# Altium project IRDiode_SWS.PrjPcb
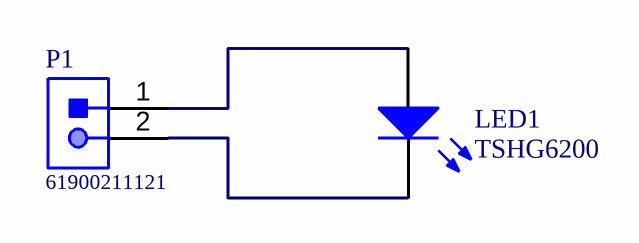
[diagram p0: IR_Diode_PCB.SchDoc]
1 sheet, 2 parts. Net scope: global (net labels, ports and power ports of the same name join across sheets).
Board file: IRDiode.PcbDoc

## Sheet IR_Diode_PCB.SchDoc: IR Diode PCB
size A3; DrawnBy: Fekunz; Revision: 1; SheetNumber: 1; SheetTotal: 1

### Parts
LED1  TSHG6200  [Type 5mm]
P1  61900211121  [61900211121]

### Nets
NetLED1_1: LED1.1(K) P1.2
NetLED1_2: LED1.2(A) P1.1

### Notes on the sheet
- Project:
- Drawn by:
- Size:
- Sheet
- A3
- Rev.:
- of
- Date:
- File:

### Library data of the parts
LED1 = CMP-1489-00005-1: PartNumber: 151053GS03000; Manufacturer: Wuerth Elektronik; Emitting color: Green; ComponentLink2URL: http://katalog.we-online.de/pbs/datasheet/7448042001.pdfhttp://katalog.we-online.de/pbs/datasheet/7448042001.pdfhttp://katalog.we-online.de/pbs/datasheet/7448042001.pdfhttp://katalog.we-online.de/pbs/datasheet/151053GS03000.pdf; ComponentLink2Description: Datasheet; ComponentLink1URL: http://www.we-online.com; PackageReference: Type 5mm; ComponentLink1Description: Manufacturer URL
P1 = CMP-1502-00584-1: Male Locking Header WR-WTB, THT, Vertical, pitch 2.54 mm, 1 x 2 position; Manufacturer: Wurth Elektronik; Position: 1x2; Contact Resistance: 20mOhm; Working Voltage: 250VAC; Pitch: 2.54mm; Gender: Male; Part Number: 61900211121; Mounting Technology: THT; Operating Temperature: -40to105degC; Orientation: Vertical; Packaging: Bag; Package Reference: 61900211121; Manufacturer URL: http://www.we-online.de; Datasheet URL: https://katalog.we-online.de/em/datasheet/6190xx11121.pdf; Publisher: WurthElektronik